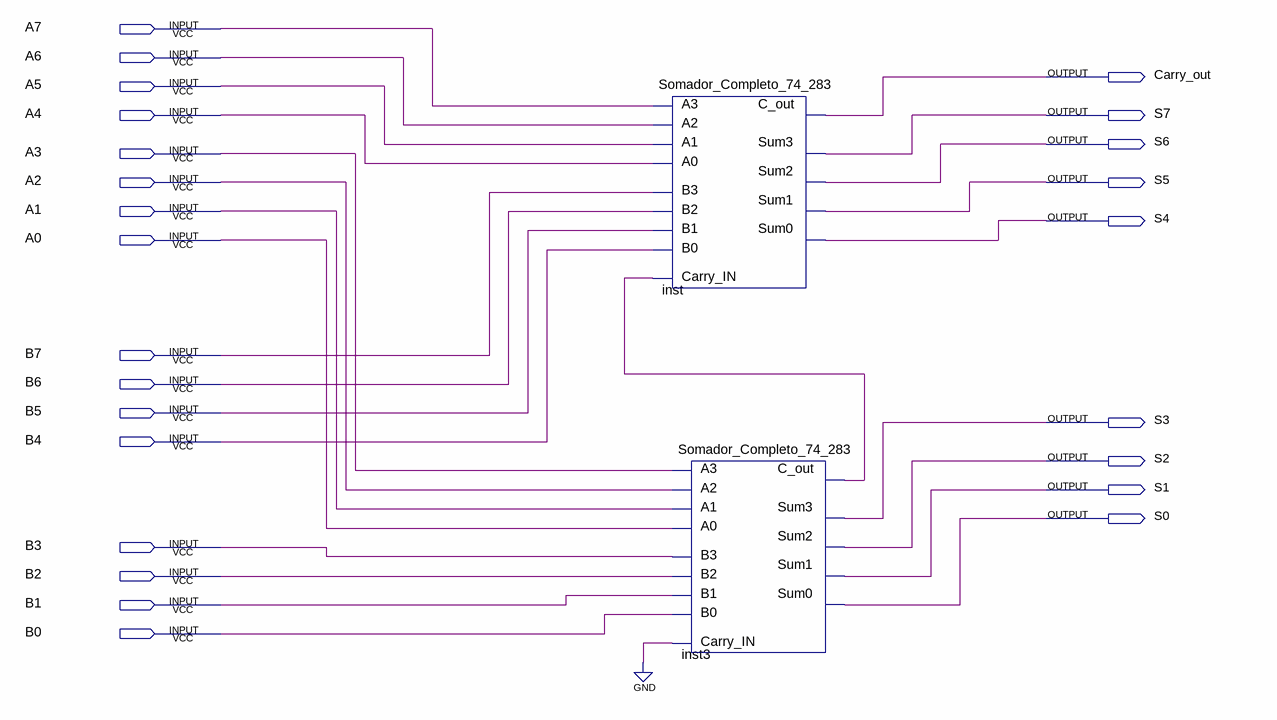
[diagram p0: schematic sheet]
// Quartus schematic Somador8bits.bdf as structural Verilog: 2 symbols, 25 pins
module Somador8bits (
  input  A7,
  input  A6,
  input  A5,
  input  A4,
  input  A3,
  input  A2,
  input  A1,
  input  A0,
  input  B7,
  input  B6,
  input  B5,
  input  B4,
  input  B3,
  input  B2,
  input  B1,
  input  B0,
  output Carry_out,
  output S7,
  output S6,
  output S5,
  output S4,
  output S3,
  output S2,
  output S1,
  output S0
);

  wire inst3_c_out;

  Somador_Completo_74_283 inst (
    .B3(B7), .A3(A7), .B2(B6), .A2(A6), .B1(B5), .A1(A5), .B0(B4), .A0(A4), .Carry_IN(inst3_c_out),
    .C_out(Carry_out), .Sum3(S7), .Sum2(S6), .Sum0(S4), .Sum1(S5));
  Somador_Completo_74_283 inst3 (
    .B3(B3), .A3(A3), .B2(B2), .A2(A2), .B1(B1), .A1(A1), .B0(B0), .A0(A0), .Carry_IN(1'b0),
    .C_out(inst3_c_out), .Sum3(S3), .Sum2(S2), .Sum0(S0), .Sum1(S1));
endmodule
